# Altium schematic sheet 04_ZYNQ_Config.SchDoc
size A3; SheetNumber: 4; SheetTotal: 9
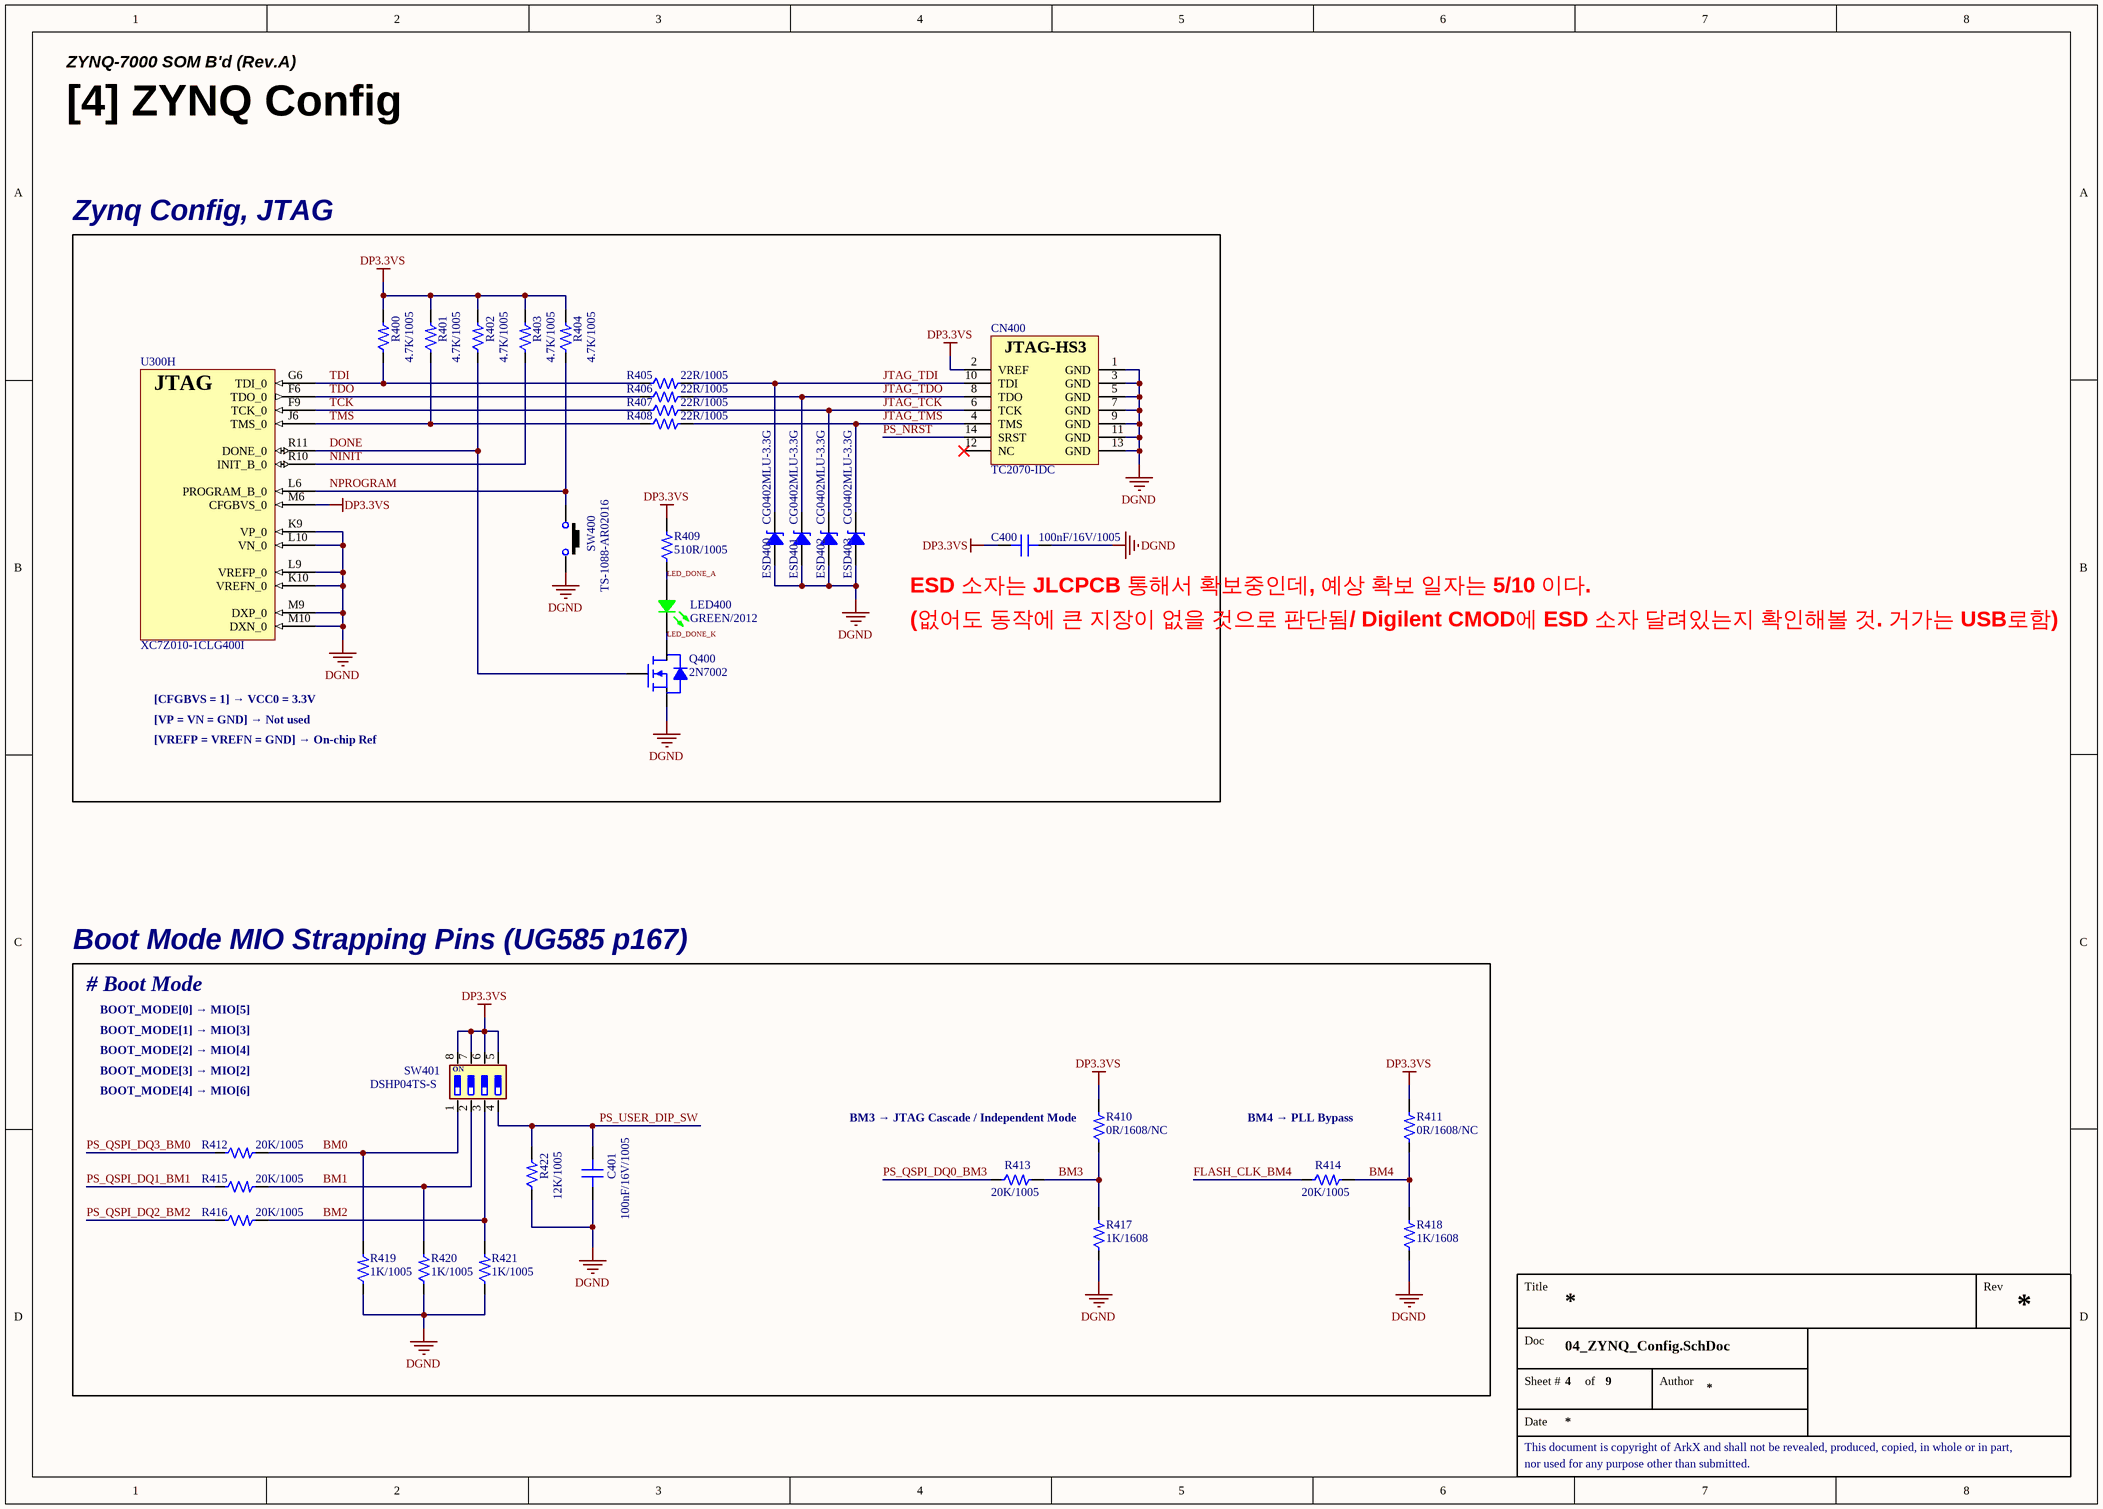
[diagram p0: 04_ZYNQ_Config.SchDoc]

## Parts
C400  100nF/16V/1005  [CAP 1005 (0402_INCH)]
C401  100nF/16V/1005  [CAP 1005 (0402_INCH)]
CN400  TC2070-IDC  [CON_TC2070-IDC]
ESD400  CG0402MLU-3.3G  [RES 1005 (0402_inch)]
ESD401  CG0402MLU-3.3G  [RES 1005 (0402_inch)]
ESD402  CG0402MLU-3.3G  [RES 1005 (0402_inch)]
ESD403  CG0402MLU-3.3G  [RES 1005 (0402_inch)]
LED400  GREEN/2012  [LED MHT170RGBCT (GREEN)]
Q400  2N7002  [SOT 23-3 (DIODES INCORPORATED)]
R400  4.7K/1005  [RES 1005 (0402_inch)]
R401  4.7K/1005  [RES 1005 (0402_inch)]
R402  4.7K/1005  [RES 1005 (0402_inch)]
R403  4.7K/1005  [RES 1005 (0402_inch)]
R404  4.7K/1005  [RES 1005 (0402_inch)]
R405  22R/1005  [RES 1005 (0402_inch)]
R406  22R/1005  [RES 1005 (0402_inch)]
R407  22R/1005  [RES 1005 (0402_inch)]
R408  22R/1005  [RES 1005 (0402_inch)]
R409  510R/1005  [RES 1005 (0402_inch)]
R410  0R/1608/NC  [RES 1608 (0603_inch)/NC]
R411  0R/1608/NC  [RES 1608 (0603_inch)/NC]
R412  20K/1005  [RES 1005 (0402_inch)]
R413  20K/1005  [RES 1005 (0402_inch)]
R414  20K/1005  [RES 1005 (0402_inch)]
R415  20K/1005  [RES 1005 (0402_inch)]
R416  20K/1005  [RES 1005 (0402_inch)]
R417  1K/1608  [RES 1608 (0603_inch)]
R418  1K/1608  [RES 1608 (0603_inch)]
R419  1K/1005  [RES 1005 (0402_inch)]
R420  1K/1005  [RES 1005 (0402_inch)]
R421  1K/1005  [RES 1005 (0402_inch)]
R422  12K/1005  [RES 1005 (0402_inch)]
SW400  TS-1088-AR02016  [SW_TS-1088-AR02016]
SW401  DSHP04TS-S  [SW_DSHP04TS-S]
U300  XC7Z010-1CLG400I  [IC_SOC_XC7Z010-1CLG400I]  (part H of 9)

## Blocks framed on the sheet
Zynq Config, JTAG: C400 CN400 ESD400-ESD403 LED400 Q400 R400-R409 SW400 U300
Boot Mode MIO Strapping Pins (UG585 p167): C401 R410-R422 SW401

## Nets
DGND: C400.1 C401.1 CN400.1(GND) CN400.3(GND) CN400.5(GND) CN400.7(GND) CN400.9(GND) CN400.11(GND) CN400.13(GND) ESD400.1 ESD401.1 ESD402.1 ESD403.1 Q400.2(S) R417.1 R418.1 R419.1 R420.1 R421.1 R422.1 SW400.2 U300.K9(VP_0) U300.K10(VREFN_0) U300.L9(VREFP_0) U300.L10(VN_0) U300.M9(DXP_0) U300.M10(DXN_0)
DP3.3VS: C400.2 CN400.2(VREF) R400.2 R401.2 R402.2 R403.2 R404.2 R409.2 R410.2 R411.2 SW401.5 SW401.6 SW401.7 SW401.8 U300.M6(CFGBVS_0)
BM0: R412.2 R419.2 SW401.1
BM1: R415.2 R420.2 SW401.2
BM2: R416.2 R421.2 SW401.3
BM3: R410.1 R413.2 R417.2
BM4: R411.1 R414.2 R418.2
DONE: Q400.1(G) R402.1 U300.R11(DONE_0)
FLASH_CLK_BM4: R414.1
JTAG_TCK: CN400.6(TCK) ESD402.2 R407.2
JTAG_TDI: CN400.10(TDI) ESD400.2 R405.2
JTAG_TDO: CN400.8(TDO) ESD401.2 R406.2
JTAG_TMS: CN400.4(TMS) ESD403.2 R408.2
LED_DONE_A: LED400.4(Common_Anode) R409.1
LED_DONE_K: LED400.2(GREEN) Q400.3(D)
NINIT: R403.1 U300.R10(INIT_B_0)
NPROGRAM: R404.1 SW400.1 U300.L6(PROGRAM_B_0)
PS_NRST: CN400.14(SRST)
PS_QSPI_DQ0_BM3: R413.1
PS_QSPI_DQ1_BM1: R415.1
PS_QSPI_DQ2_BM2: R416.1
PS_QSPI_DQ3_BM0: R412.1
PS_USER_DIP_SW: C401.2 R422.2 SW401.4
TCK: R407.1 U300.F9(TCK_0)
TDI: R400.1 R405.1 U300.G6(TDI_0)
TDO: R406.1 U300.F6(TDO_0)
TMS: R401.1 R408.1 U300.J6(TMS_0)

Not connected (* = marked no-connect by the designer): CN400 12(NC)*

## Notes on the sheet
- ZYNQ-7000 SOM B'd (Rev.A)
- [4] ZYNQ Config
- (near C400) ESD 소자는 JLCPCB 통해서 확보중인데, 예상 확보 일자는 5/10 이다.
- (없어도 동작에 큰 지장이 없을 것으로 판단됨/ Digilent CMOD에 ESD 소자 달려있는지 확인해볼 것. 거가는 USB로함)
- [CFGBVS = 1] → VCC0 = 3.3V
- [VP = VN = GND] → Not used
- [VREFP = VREFN = GND] → On-chip Ref
- # Boot Mode
- BOOT_MODE[0] → MIO[5]
- BOOT_MODE[1] → MIO[3]
- BOOT_MODE[2] → MIO[4]
- BOOT_MODE[3] → MIO[2]
- BOOT_MODE[4] → MIO[6]
- (near R410) BM3 → JTAG Cascade / Independent Mode
- BM4 → PLL Bypass
- Title
- Rev
- Doc
- Sheet #
- of
- Author
- This document is copyright of ArkX and shall not be revealed, produced, copied, in whole or in part,
- Date
- nor used for any purpose other than submitted.
- (in symbol CON_TC2070-IDC(JTAG-HS3)) JTAG-HS3
- (in symbol IC_SOC_XC7Z010-1CLG400I, part H) JTAG
- (in symbol SW_DSHP04TS-S) ON

## Library data of the parts
C400 C401 = CAP_100nF/16V/1005: Ceramic CAP_100nF/16V/1005; LCSC Part #: C1525; JLCPCB Part Type: Basic Part
CN400 = CON_TC2070-IDC(JTAG-HS3): TC2070 14-pin Plug-of-Nails™ (with legs) to 14 pin 2mm female IDC connector.
ESD400-ESD403 = ESD_CG0402MLU-3.3G: Varistor 1 Circuit Surface Mount, MLCV 0402 (1005 Metric); LCSC Part #: C2655393; JLCPCB Part Type: Extended Part
LED400 = LED_MHT170RGBCT(GREEN): Colorless transparence -30℃~+85℃ Positive post Common anode RGB 120° 0805  Light Emitting Diodes (LED) ROHS; LCSC Part #: C2962094; JLCPCB Part Type: Extended Part
Q400 = FET_2N7002: 60V 115mA 200mW 7.5Ω@10V,500mA N Channel SOT-23  MOSFETs ROHS; LCSC Part #: C8545; JLCPCB Part Type: Basic Part
R400-R404 = RES_4.7K/1005/62.5mW: Value: 4.7K; Power Rating: 62.5mW; Precision: 1%; Size: 1005; LCSC Part #: C25900; JLCPCB Part Type: Basic Part
R405-R408 = RES_22R/1005/62.5mW: Value: 22R; Power Rating: 62.5mW; Precision: 1%; Size: 1005; LCSC Part #: C25092; JLCPCB Part Type: Basic Part
R409 = RES_510R/1005/62.5mW: Value: 510R; Power Rating: 62.5mW; Precision: 1%; Size: 1005; LCSC Part #: C25123; JLCPCB Part Type: Basic Part
R410 R411 = RES_NC_0R/1608/0.1W: 0R/1608/0.1W/NC; Value: 0R; Power Rating: 0.1W; Precision: 1%; Size: 1608
R412-R416 = RES_20K/1005/62.5mW: Value: 20K; Power Rating: 62.5mW; Precision: 1%; Size: 1005; LCSC Part #: C25765; JLCPCB Part Type: Basic Part
R417 R418 = RES_1K/1608/0.1W: Value: 1K; Power Rating: 0.1W; Precision: 1%; Size: 1608; LCSC Part #: C21190; JLCPCB Part Type: Basic Part
R419-R421 = RES_1K/1005/62.5mW: Value: 1K; Power Rating: 62.5mW; Precision: 1%; Size: 1005; LCSC Part #: C11702; JLCPCB Part Type: Basic Part
R422 = RES_12K/1005/62.5mW: Value: 12K; Power Rating: 62.5mW; Precision: 1%; Size: 1005; LCSC Part #: C25752; JLCPCB Part Type: Basic Part
SW400 = SW_TS-1088-AR02016: NO 50mA 100MΩ 100000 Times 12V 160gf@±50gf Brick nogging SPST SMD  Tactile Switches ROHS; LCSC Part #: C720477; JLCPCB Part Type: Extended Part
SW401 = SW_DSHP04TS-S: 4Bit SPST 24V 25mA Black 3千次 Slide (Standard),凹槽式 SMD-8P,5.4x6.7mm  DIP Switches ROHS; LCSC Part #: C319050; JLCPCB Part Type: Extended Part
U300 = IC_SOC_XC7Z010-1CLG400I: Dual ARM® Cortex®-A9 MPCore™ with CoreSight™ System On Chip (SOC) IC Zynq®-7000 Artix™-7 FPGA, 28K Logic Cells 766MHz 400-CSPBGA (17x17); LCSC Part #: C2840994; JLCPCB Part Type: Extended Part